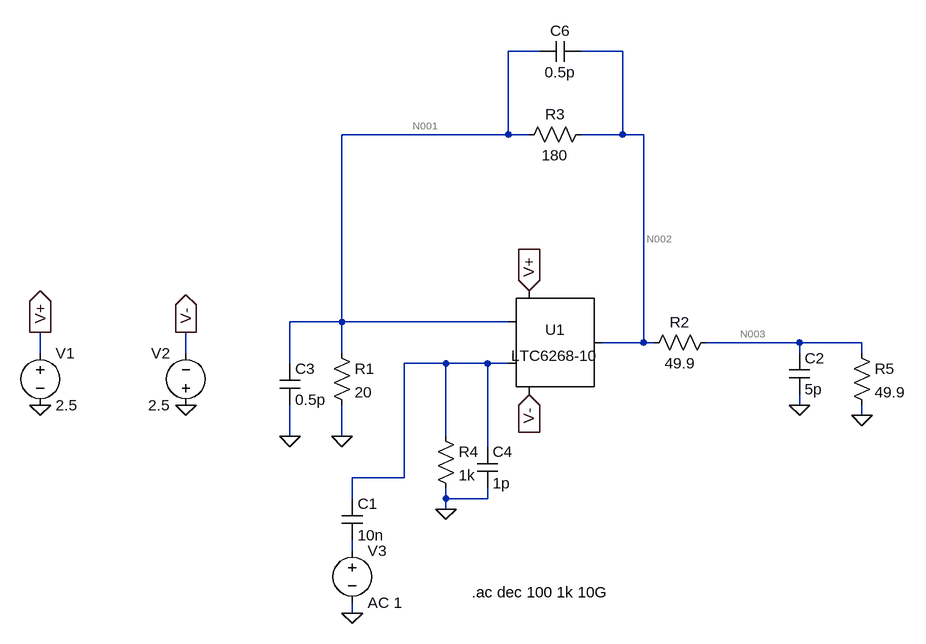
[diagram p0: schematic LTC6268-10_non-inverting.asc]
LTC6268-10_non-inverting.asc, the LTspice schematic file:
Version 4
SHEET 1 2104 680
WIRE 864 -224 816 -224
WIRE 992 -224 928 -224
WIRE 816 -96 816 -224
WIRE 816 -96 560 -96
WIRE 848 -96 816 -96
WIRE 992 -96 992 -224
WIRE 992 -96 928 -96
WIRE 1024 -96 992 -96
WIRE 560 192 560 -96
WIRE 560 192 480 192
WIRE 816 192 560 192
WIRE 1024 224 1024 -96
WIRE 1024 224 960 224
WIRE 1040 224 1024 224
WIRE 1264 224 1120 224
WIRE 1360 224 1264 224
WIRE 96 240 96 208
WIRE 320 240 320 208
WIRE 560 240 560 192
WIRE 1264 240 1264 224
WIRE 1360 240 1360 224
WIRE 480 256 480 192
WIRE 720 256 656 256
WIRE 784 256 720 256
WIRE 816 256 784 256
WIRE 1264 320 1264 304
WIRE 1360 336 1360 320
WIRE 480 368 480 320
WIRE 560 368 560 320
WIRE 720 368 720 256
WIRE 784 384 784 256
WIRE 656 432 656 256
WIRE 656 432 576 432
WIRE 576 464 576 432
WIRE 720 464 720 448
WIRE 784 464 784 448
WIRE 784 464 720 464
WIRE 720 480 720 464
WIRE 576 544 576 528
WIRE 576 640 576 624
FLAG 96 320 0
FLAG 320 320 0
FLAG 96 208 V+
IOPIN 96 208 Out
FLAG 320 208 V-
IOPIN 320 208 Out
FLAG 848 304 V-
IOPIN 848 304 In
FLAG 848 144 V+
IOPIN 848 144 In
FLAG 560 368 0
FLAG 576 640 0
FLAG 720 480 0
FLAG 1264 320 0
FLAG 480 368 0
FLAG 1360 336 0
SYMBOL voltage 96 224 R0
WINDOW 123 0 0 Left 2
WINDOW 39 0 0 Left 2
SYMATTR InstName V1
SYMATTR Value 2.5
SYMBOL voltage 320 336 R180
WINDOW 0 24 96 Left 2
WINDOW 3 24 16 Left 2
SYMATTR InstName V2
SYMATTR Value 2.5
SYMBOL res 944 -112 R90
WINDOW 0 0 56 VBottom 2
WINDOW 3 32 56 VTop 2
SYMATTR InstName R3
SYMATTR Value 180
SYMBOL cap 928 -240 R90
WINDOW 0 0 32 VBottom 2
WINDOW 3 32 32 VTop 2
SYMATTR InstName C6
SYMATTR Value 0.5p
SYMBOL voltage 576 528 R0
SYMATTR InstName V3
SYMATTR Value AC 1
SYMBOL Opamps\\LTC6268-10 848 224 R0
SYMATTR InstName U1
SYMBOL res 544 224 R0
SYMATTR InstName R1
SYMATTR Value 20
SYMBOL res 1136 208 R90
WINDOW 0 0 56 VBottom 2
WINDOW 3 32 56 VTop 2
SYMATTR InstName R2
SYMATTR Value 49.9
SYMBOL cap 560 464 R0
SYMATTR InstName C1
SYMATTR Value 10n
SYMBOL res 704 352 R0
SYMATTR InstName R4
SYMATTR Value 1k
SYMBOL cap 1248 240 R0
SYMATTR InstName C2
SYMATTR Value 5p
SYMBOL cap 464 256 R0
SYMATTR InstName C3
SYMATTR Value 0.5p
SYMBOL cap 768 384 R0
SYMATTR InstName C4
SYMATTR Value 1p
SYMBOL res 1344 224 R0
SYMATTR InstName R5
SYMATTR Value 49.9
TEXT 760 608 Left 2 !.ac dec 100 1k 10G

The netlist it stands for:
* LTC6268-10_non-inverting.asc
V1 V+ 0 2.5
V2 0 V- 2.5
R3 N002 N001 180
C6 N002 N001 0.5p
V3 N005 0 AC 1
XU1 N004 N001 N002 V+ V- NC_01 LTC6268-10
R1 N001 0 20
R2 N003 N002 49.9
C1 N004 N005 10n
R4 N004 0 1k
C2 N003 0 5p
C3 N001 0 0.5p
C4 N004 0 1p
R5 N003 0 49.9
.ac dec 100 1k 10G
.lib LTC2.lib
.backanno
.end

* Results of the author's LTspice run, read from the files saved beside the schematic
* Operating Point, zero values left out:
*   V(v+) = 2.5 V
*   V(v-) = -2.5 V
*   V(n002) = 1.062 µV
*   V(n001) = 106.2 nV
*   V(n003) = 530.8 nV
*   I(R5) = 10.64 nA
*   I(R2) = -10.64 nA
*   I(R1) = 5.308 nA
*   I(R3) = 5.308 nA
*   I(V2) = -16.37 mA
*   I(V1) = -16.37 mA
*   Ix(u1:3) = -15.94 nA
*   Ix(u1:4) = 16.37 mA
*   Ix(u1:5) = -16.37 mA
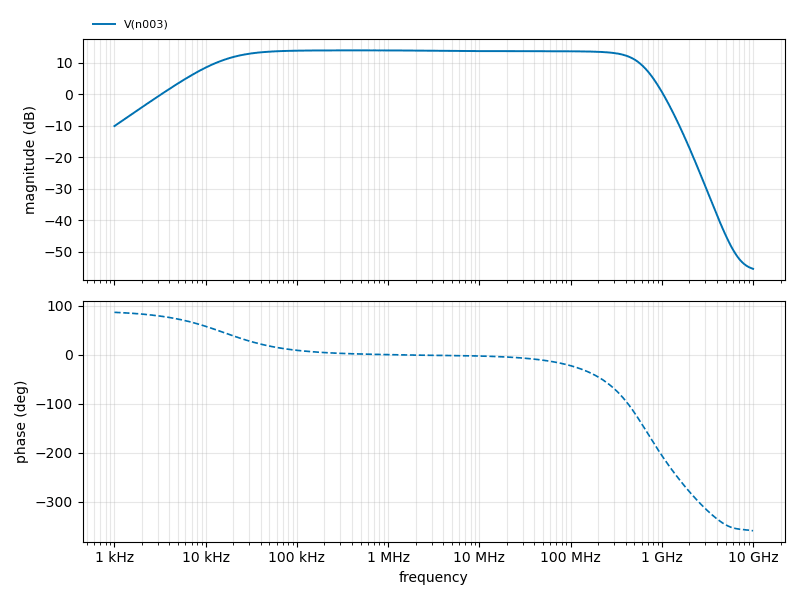
[diagram p1: AC Analysis of LTC6268-10_non-inverting.asc, plotted from the saved traces]
* AC Analysis, 1 run:
*   V(n003): -10.09 dB at 1 kHz, -55.44 dB at 10 GHz, peak 13.95 dB at 457.1 kHz, 3 dB below the peak at 15.87 kHz and 508.1 MHz